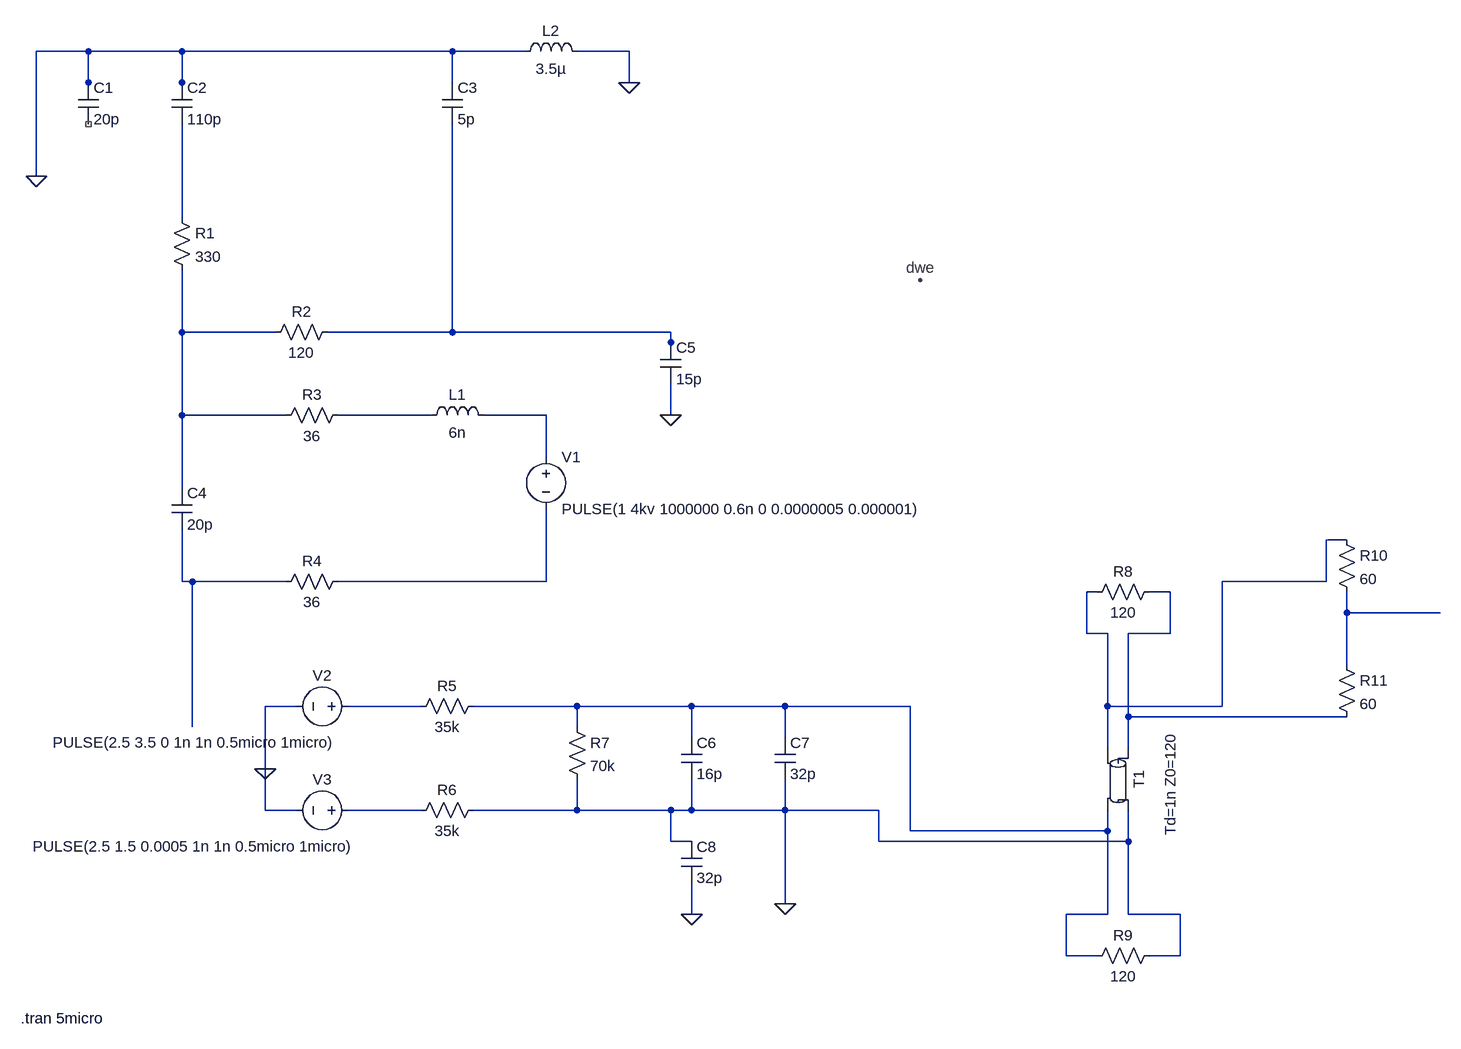
[diagram p0: schematic Simulation.asc]
Simulation.asc, the LTspice schematic file:
Version 4
SHEET 1 2168 1680
WIRE -48 -48 -128 -48
WIRE 96 -48 -48 -48
WIRE 512 -48 96 -48
WIRE 624 -48 512 -48
WIRE 784 -48 704 -48
WIRE -48 0 -48 -48
WIRE 96 0 96 -48
WIRE 512 0 512 -48
WIRE 784 0 784 -48
WIRE -48 16 -48 0
WIRE 96 16 96 0
WIRE -128 144 -128 -48
WIRE 96 208 96 64
WIRE 96 384 96 288
WIRE 240 384 96 384
WIRE 512 384 512 64
WIRE 512 384 320 384
WIRE 848 384 512 384
WIRE 848 400 848 384
WIRE 848 416 848 400
WIRE 96 512 96 384
WIRE 256 512 96 512
WIRE 480 512 336 512
WIRE 656 512 560 512
WIRE 848 512 848 464
WIRE 656 576 656 512
WIRE 96 624 96 512
WIRE 1888 704 1856 704
WIRE 96 768 96 688
WIRE 112 768 96 768
WIRE 256 768 112 768
WIRE 656 768 656 656
WIRE 656 768 336 768
WIRE 1856 768 1856 704
WIRE 1856 768 1696 768
WIRE 1504 784 1488 784
WIRE 1616 784 1584 784
WIRE 1888 816 1888 784
WIRE 2032 816 1888 816
WIRE 1488 848 1488 784
WIRE 1520 848 1488 848
WIRE 1616 848 1616 784
WIRE 1616 848 1552 848
WIRE 1888 896 1888 816
WIRE 272 960 224 960
WIRE 464 960 352 960
WIRE 704 960 544 960
WIRE 880 960 704 960
WIRE 1024 960 880 960
WIRE 1216 960 1024 960
WIRE 1520 960 1520 848
WIRE 1696 960 1696 768
WIRE 1696 960 1520 960
WIRE 1552 976 1552 848
WIRE 1888 976 1552 976
WIRE 112 992 112 768
WIRE 704 992 704 960
WIRE 880 1008 880 960
WIRE 1024 1008 1024 960
WIRE 1520 1024 1520 960
WIRE 1552 1024 1552 976
WIRE 224 1056 224 960
WIRE 224 1120 224 1056
WIRE 272 1120 224 1120
WIRE 464 1120 352 1120
WIRE 704 1120 704 1072
WIRE 704 1120 544 1120
WIRE 848 1120 704 1120
WIRE 880 1120 880 1072
WIRE 880 1120 848 1120
WIRE 1024 1120 1024 1072
WIRE 1024 1120 880 1120
WIRE 1168 1120 1024 1120
WIRE 1216 1152 1216 960
WIRE 1520 1152 1520 1120
WIRE 1520 1152 1216 1152
WIRE 848 1168 848 1120
WIRE 880 1168 848 1168
WIRE 1168 1168 1168 1120
WIRE 1552 1168 1552 1120
WIRE 1552 1168 1168 1168
WIRE 1024 1264 1024 1120
WIRE 880 1280 880 1232
WIRE 1520 1280 1520 1152
WIRE 1520 1280 1456 1280
WIRE 1552 1280 1552 1168
WIRE 1632 1280 1552 1280
WIRE 1456 1344 1456 1280
WIRE 1504 1344 1456 1344
WIRE 1632 1344 1632 1280
WIRE 1632 1344 1584 1344
FLAG -128 144 0
FLAG 784 0 0
FLAG 848 512 0
FLAG 1232 304 dwe
FLAG 1024 1264 0
FLAG 880 1280 0
FLAG 224 1056 0
DATAFLAG 656 656 ""
SYMBOL cap -64 0 R0
SYMATTR InstName C1
SYMATTR Value 20p
SYMBOL cap 80 0 R0
SYMATTR InstName C2
SYMATTR Value 110p
SYMBOL cap 496 0 R0
SYMATTR InstName C3
SYMATTR Value 5p
SYMBOL res 80 192 R0
SYMATTR InstName R1
SYMATTR Value 330
SYMATTR SpiceLine tol=1
SYMBOL res 336 368 R90
WINDOW 0 0 56 VBottom 2
WINDOW 3 32 56 VTop 2
SYMATTR InstName R2
SYMATTR Value 120
SYMATTR SpiceLine tol=1
SYMBOL res 352 496 R90
WINDOW 0 0 56 VBottom 2
WINDOW 3 32 56 VTop 2
SYMATTR InstName R3
SYMATTR Value 36
SYMATTR SpiceLine tol=1
SYMBOL ind 464 528 R270
WINDOW 0 32 56 VTop 2
WINDOW 3 5 56 VBottom 2
SYMATTR InstName L1
SYMATTR Value 6n
SYMBOL cap 80 624 R0
SYMATTR InstName C4
SYMATTR Value 20p
SYMBOL res 352 752 R90
WINDOW 0 0 56 VBottom 2
WINDOW 3 32 56 VTop 2
SYMATTR InstName R4
SYMATTR Value 36
SYMATTR SpiceLine tol=1
SYMBOL ind 608 -32 R270
WINDOW 0 32 56 VTop 2
WINDOW 3 5 56 VBottom 2
SYMATTR InstName L2
SYMATTR Value 3.5µ
SYMBOL cap 832 400 R0
SYMATTR InstName C5
SYMATTR Value 15p
SYMBOL voltage 656 560 R0
WINDOW 123 0 0 Left 0
WINDOW 39 0 0 Left 0
SYMATTR InstName V1
SYMATTR Value PULSE(1 4kv 1000000 0.6n 0 0.0000005 0.000001)
SYMBOL voltage 368 960 R90
WINDOW 0 -32 56 VBottom 2
WINDOW 3 40 253 VTop 2
WINDOW 123 0 0 Left 0
WINDOW 39 0 0 Left 0
SYMATTR InstName V2
SYMATTR Value PULSE(2.5 3.5 0 1n 1n 0.5micro 1micro)
SYMBOL res 560 944 R90
WINDOW 0 0 56 VBottom 2
WINDOW 3 32 56 VTop 2
SYMATTR InstName R5
SYMATTR Value 35k
SYMATTR SpiceLine tol=1
SYMBOL res 560 1104 R90
WINDOW 0 0 56 VBottom 2
WINDOW 3 32 56 VTop 2
SYMATTR InstName R6
SYMATTR Value 35k
SYMATTR SpiceLine tol=1
SYMBOL res 688 976 R0
SYMATTR InstName R7
SYMATTR Value 70k
SYMBOL cap 864 1008 R0
SYMATTR InstName C6
SYMATTR Value 16p
SYMBOL cap 1008 1008 R0
SYMATTR InstName C7
SYMATTR Value 32p
SYMBOL cap 864 1168 R0
SYMATTR InstName C8
SYMATTR Value 32p
SYMBOL voltage 368 1120 R90
WINDOW 0 -32 56 VBottom 2
WINDOW 3 40 253 VTop 2
WINDOW 123 0 0 Left 0
WINDOW 39 0 0 Left 0
SYMATTR InstName V3
SYMATTR Value PULSE(2.5 1.5 0.0005 1n 1n 0.5micro 1micro)
SYMBOL tline 1536 1072 R90
WINDOW 3 7 -96 Top 2
SYMATTR Value Td=1n Z0=120
SYMATTR InstName T1
SYMBOL res 1872 688 R0
SYMATTR InstName R10
SYMATTR Value 60
SYMBOL res 1872 880 R0
SYMATTR InstName R11
SYMATTR Value 60
SYMBOL res 1600 768 R90
WINDOW 0 0 56 VBottom 2
WINDOW 3 32 56 VTop 2
SYMATTR InstName R8
SYMATTR Value 120
SYMBOL res 1600 1328 R90
WINDOW 0 0 56 VBottom 2
WINDOW 3 32 56 VTop 2
SYMATTR InstName R9
SYMATTR Value 120
TEXT -152 1440 Left 2 !.tran 5micro

The netlist it stands for:
* Simulation.asc
C1 0 NC_01 20p
C2 0 N001 110p
C3 0 N003 5p
R1 N001 N002 330 tol=1
R2 N003 N002 120 tol=1
R3 N004 N002 36 tol=1
L1 N004 N005 6n
C4 N002 N007 20p
R4 N008 N007 36 tol=1
L2 0 0 3.5µ
C5 N003 0 15p
V1 N005 N008 PULSE(1 4kv 1000000 0.6n 0 0.0000005 0.000001)
V2 N011 0 PULSE(2.5 3.5 0 1n 1n 0.5micro 1micro)
R5 N012 N011 35k tol=1
R6 0 N013 35k tol=1
R7 N012 0 70k
C6 N012 0 16p
C7 N012 0 32p
C8 0 0 32p
V3 N013 0 PULSE(2.5 1.5 0.0005 1n 1n 0.5micro 1micro)
T1 N009 N006 0 N012 Td=1n Z0=120
R10 N006 N010 60
R11 N010 N009 60
R8 N009 N006 120
R9 0 N012 120
.tran 5micro
.backanno
.end